# Altium schematic sheet ProtectionCPLD.SchDoc
size 594 x 420 mm; Address1: Address1; Address2: Address2; Address3: Address3; Address4: Address4; DocumentNumber: АБВГ.123456.001 Э3; SheetNumber: 4; SheetTotal: 5; Scale: 1:1; DocumentType: Схема электрическая принципиальная; FirstReferrence: АБВГ.123456.001
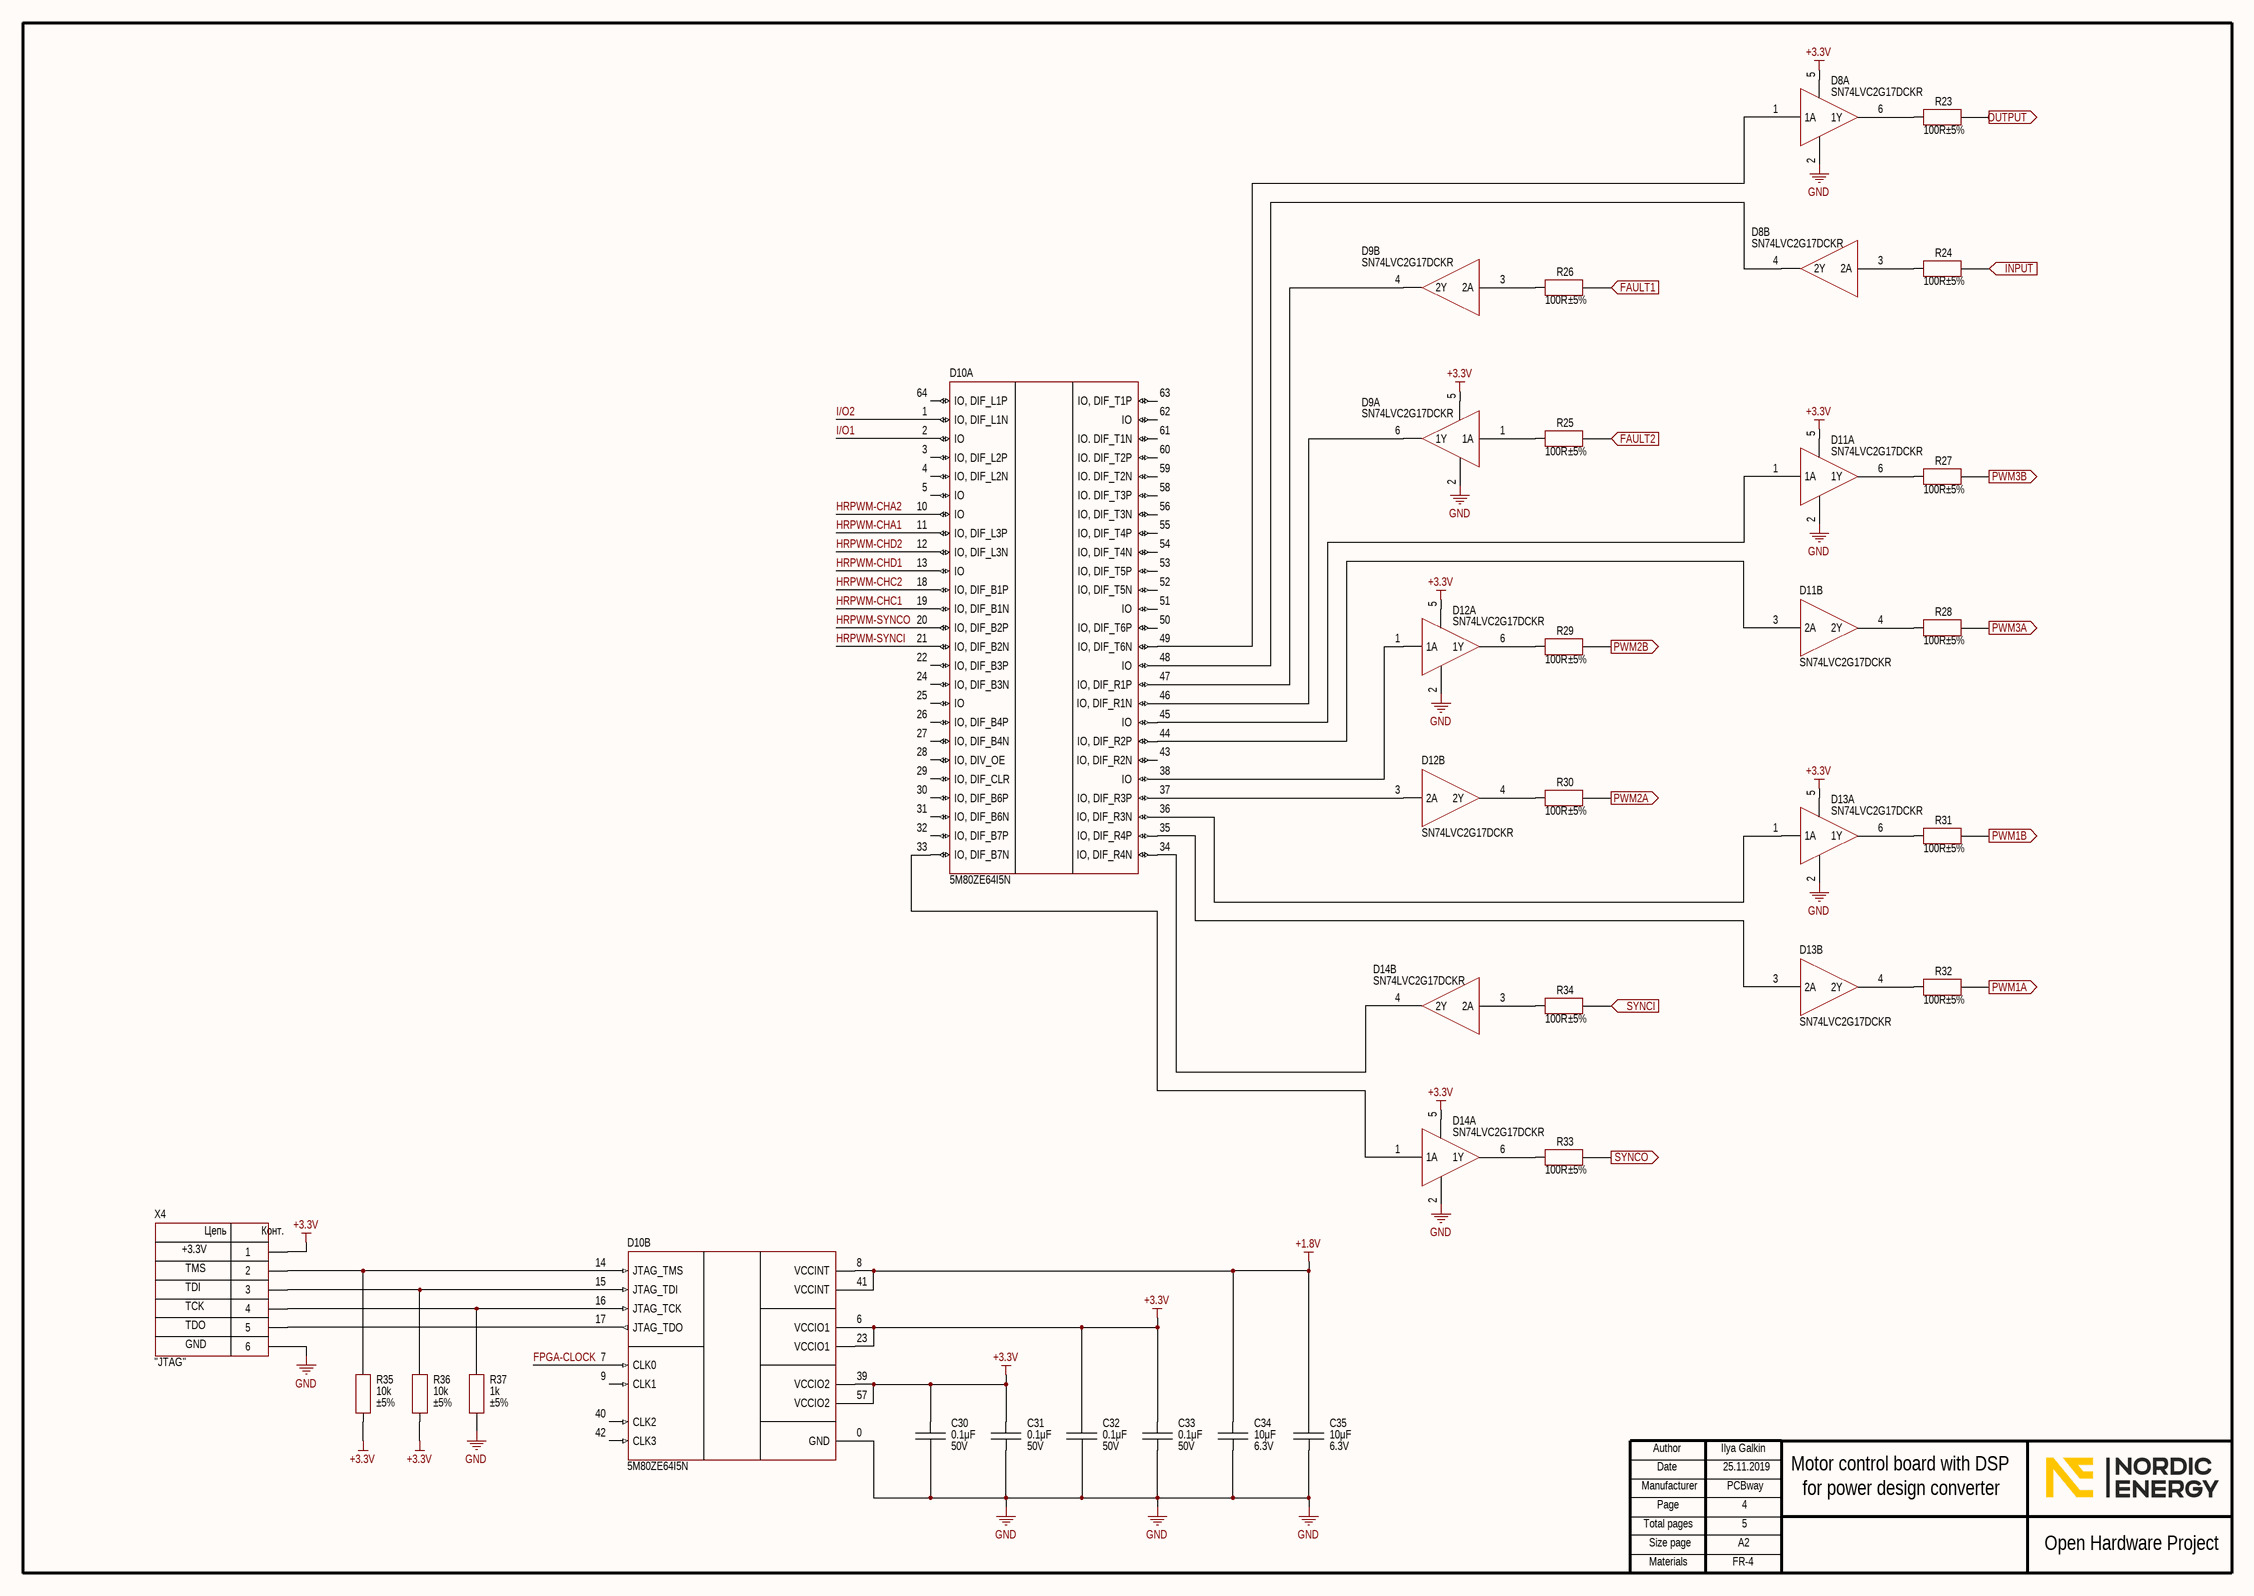
[diagram p0: ProtectionCPLD.SchDoc]

## Parts
C30  value 0.1μF  Voltage: 50V  [CAP: 0603]
C31  value 0.1μF  Voltage: 50V  [CAP: 0603]
C32  value 0.1μF  Voltage: 50V  [CAP: 0603]
C33  value 0.1μF  Voltage: 50V  [CAP: 0603]
C34  value 10μF  Voltage: 6.3V  [CAP: 0603]
C35  value 10μF  Voltage: 6.3V  [CAP: 0603]
D8  (no value)  [SC70-6]  (parts A,B of 2)
D9  (no value)  [SC70-6]  (parts A,B of 2)
D10  (no value)  [64-EQFP]  (parts A,B of 2)
D11  (no value)  [SC70-6]  (parts A,B of 2)
D12  (no value)  [SC70-6]  (parts A,B of 2)
D13  (no value)  [SC70-6]  (parts A,B of 2)
D14  (no value)  [SC70-6]  (parts A,B of 2)
R23  value 100R  Tolerance: ±5%  [RES: 0603]
R24  value 100R  Tolerance: ±5%  [RES: 0603]
R25  value 100R  Tolerance: ±5%  [RES: 0603]
R26  value 100R  Tolerance: ±5%  [RES: 0603]
R27  value 100R  Tolerance: ±5%  [RES: 0603]
R28  value 100R  Tolerance: ±5%  [RES: 0603]
R29  value 100R  Tolerance: ±5%  [RES: 0603]
R30  value 100R  Tolerance: ±5%  [RES: 0603]
R31  value 100R  Tolerance: ±5%  [RES: 0603]
R32  value 100R  Tolerance: ±5%  [RES: 0603]
R33  value 100R  Tolerance: ±5%  [RES: 0603]
R34  value 100R  Tolerance: ±5%  [RES: 0603]
R35  value 10k  Tolerance: ±5%  [RES: 0603]
R36  value 10k  Tolerance: ±5%  [RES: 0603]
R37  value 1k  Tolerance: ±5%  [RES: 0603]
X4  CommentText: "JTAG"  [CON: SM06B-GHS]

## Ports
FAULT1 (in), FAULT2 (in), INPUT (in), OUTPUT (out), PWM1A (out), PWM1B (out), PWM2A (out), PWM2B (out), PWM3A (out), PWM3B (out), SYNCI (in), SYNCO (out)

## Nets
+1.8V: C34.2 C35.2 D10.8(VCCINT) D10.41(VCCINT)
+3.3V: C30.2 C31.2 C32.2 C33.2 D8.5 D9.5 D10.6(VCCIO1) D10.23(VCCIO1) D10.39(VCCIO2) D10.57(VCCIO2) D11.5 D12.5 D13.5 D14.5 R35.1 R36.1 X4.1
GND: C30.1 C31.1 C32.1 C33.1 C34.1 C35.1 D8.2 D9.2 D10.0(GND) D11.2 D12.2 D13.2 D14.2 R37.1 X4.6
FAULT1: R26.2 ; port FAULT1
FAULT2: R25.2 ; port FAULT2
FPGA-CLOCK: D10.7(CLK0)
HRPWM-CHA1: D10.11(IO,_DIF_L3P)
HRPWM-CHA2: D10.10(IO)
HRPWM-CHC1: D10.19(IO,_DIF_B1N)
HRPWM-CHC2: D10.18(IO,_DIF_B1P)
HRPWM-CHD1: D10.13(IO)
HRPWM-CHD2: D10.12(IO,_DIF_L3N)
HRPWM-SYNCI: D10.21(IO,_DIF_B2N)
HRPWM-SYNCO: D10.20(IO,_DIF_B2P)
I/O1: D10.2(IO)
I/O2: D10.1(IO,_DIF_L1N)
INPUT: R24.2 ; port INPUT
OUTPUT: R23.2 ; port OUTPUT
PWM1A: R32.2 ; port PWM1A
PWM1B: R31.2 ; port PWM1B
PWM2A: R30.2 ; port PWM2A
PWM2B: R29.2 ; port PWM2B
PWM3A: R28.2 ; port PWM3A
PWM3B: R27.2 ; port PWM3B
SYNCI: R34.2 ; port SYNCI
SYNCO: R33.2 ; port SYNCO
NetD8_1: D8.1(1A) D10.49(IO,_DIF_T6N)
NetD8_3: D8.3(2A) R24.1
NetD8_4: D8.4(2Y) D10.48(IO)
NetD8_6: D8.6(1Y) R23.1
NetD9_1: D9.1(1A) R25.1
NetD9_3: D9.3(2A) R26.1
NetD9_4: D9.4(2Y) D10.47(IO,_DIF_R1P)
NetD9_6: D9.6(1Y) D10.46(IO,_DIF_R1N)
NetD10_14: D10.14(JTAG_TMS) R35.2 X4.2
NetD10_15: D10.15(JTAG_TDI) R36.2 X4.3
NetD10_16: D10.16(JTAG_TCK) R37.2 X4.4
NetD10_17: D10.17(JTAG_TDO) X4.5
NetD10_33: D10.33(IO,_DIF_B7N) D14.1(1A)
NetD10_34: D10.34(IO,_DIF_R4N) D14.4(2Y)
NetD10_35: D10.35(IO,_DIF_R4P) D13.3(2A)
NetD10_36: D10.36(IO,_DIF_R3N) D13.1(1A)
NetD10_37: D10.37(IO,_DIF_R3P) D12.3(2A)
NetD10_38: D10.38(IO) D12.1(1A)
NetD10_44: D10.44(IO,_DIF_R2P) D11.3(2A)
NetD10_45: D10.45(IO) D11.1(1A)
NetD11_4: D11.4(2Y) R28.1
NetD11_6: D11.6(1Y) R27.1
NetD12_4: D12.4(2Y) R30.1
NetD12_6: D12.6(1Y) R29.1
NetD13_4: D13.4(2Y) R32.1
NetD13_6: D13.6(1Y) R31.1
NetD14_3: D14.3(2A) R34.1
NetD14_6: D14.6(1Y) R33.1

Not connected (* = marked no-connect by the designer): D10 3(IO,_DIF_L2P) 4(IO,_DIF_L2N) 5(IO) 9(CLK1) 22(IO,_DIF_B3P) 24(IO,_DIF_B3N) 25(IO) 26(IO,_DIF_B4P) 27(IO,_DIF_B4N) 28(IO,_DIV_OE) 29(IO,_DIF_CLR) 30(IO,_DIF_B6P) 31(IO,_DIF_B6N) 32(IO,_DIF_B7P) 40(CLK2) 42(CLK3) 43(IO,_DIF_R2N) 50(IO,_DIF_T6P) 51(IO) 52(IO,_DIF_T5N) 53(IO,_DIF_T5P) 54(IO,_DIF_T4N) 55(IO,_DIF_T4P) 56(IO,_DIF_T3N) 58(IO._DIF_T3P) 59(IO._DIF_T2N) 60(IO._DIF_T2P) 61(IO._DIF_T1N) 62(IO) 63(IO,_DIF_T1P) 64(IO,_DIF_L1P)

## Notes on the sheet
- +3.3V
- TMS
- TDI
- TCK
- TDO
- GND
- Ilya Galkin
- 25.11.2019
- PCBway
- 4
- Motor control board with DSP
- for power design converter
- 5
- FR-4
- Author
- Manufacturer
- Date
- Page
- Total pages
- Size page
- A2
- Open Hardware Project
- Materials
- (in symbol Connector_SM06B) Цепь; Конт.

## Library data of the parts
C30-C33 = Ceramic_0603: Manufacturer: Samsung; PartNumber: CL10B104KB8NNNC; ValueManufacturerPartNumber: Ceramic capacitor, 0.1μF, X7R, ±10%, 50V, 0603, -55...+125°C; TypeCapacitor: Ceramic capacitor; Tolerance: ±10%; TypeDielectric: X7R; Package: 0603; HelpURL: https://www.digikey.com/product-detail/en/samsung-electro-mechanics/CL10B104KB8NNNC/1276-1000-1-ND/3889086; Temperature: -55...+125°C
C34 C35 = Ceramic_0603: Manufacturer: Samsung; PartNumber: CL10B106MQ8NRNC; ValueManufacturerPartNumber: Ceramic capacitor, 10μF, X7R, ±10%, 6.3V, 0603, -55...+125°C; TypeCapacitor: Ceramic capacitor; Tolerance: ±10%; TypeDielectric: X7R; Package: 0603; HelpURL: https://www.digikey.com/product-detail/en/samsung-electro-mechanics/CL10B106MQ8NRNC/1276-1948-1-ND/3890034; Temperature: -55...+125°C
D8 D9 D11-D14 = SN74LVC2G17DCKR: Buffer; Manufacturer: Texas Instruments; ValueManufacturerPartNumber: IC logic buffer, 1.65...5.5V, -40...+125°C, SC-70-6; Supply: 1.65...5.5V; HelpURL: https://www.digikey.com/product-detail/en/texas-instruments/SN74LVC2G17DCKR/296-13013-1-ND/479736; Package: SC-70-6; ComponentType: IC logic buffer; Temperature: -40...+125°C; PartNumber: SN74LVC2G17DCKR
D10 = 5M80ZE64I5N: CPLD Max V; Manufacturer: Intel; ValueManufacturerPartNumber: IC CPLD logic, MAX V, 100MHz, 80LE, 1.71...1.89V, -40...+100°C, 64-EQFP; Supply: 1.71...1.89V; Speed: 100MHz; LogicElements: 80LE; HelpURL: https://www.digikey.com/product-detail/en/intel/5M80ZE64I5N/544-2817-ND/2660734; Package: 64-EQFP; ComponentType: IC CPLD logic; Temperature: -40...+100°C; Series: MAX V; PartNumber: 5M80ZE64I5N
R23-R34 = Resistor_0603: Manufacturer: Yageo; PartNumber: RC0603JR-07100RL; ValueManufacturerPartNumber: Resistor film, 100R, ±5%, 0603, 0.1W, -55...+125°C; TypeResistor: Resistor film; Power: 0.1W; Package: 0603; HelpURL: https://www.digikey.com/product-detail/en/yageo/RC0603JR-07100RL/311-100GRCT-ND/729644; Temperature: -55...+125°C
R35 R36 = Resistor_0603: Manufacturer: Yageo; PartNumber: RC0603JR-0710KL; ValueManufacturerPartNumber: Resistor film, 10k, ±5%, 0603, 0.1W, -55...+125°C; TypeResistor: Resistor film; Power: 0.1W; Package: 0603; HelpURL: https://www.digikey.com/product-detail/en/yageo/RC0603JR-0710KL/311-10KGRCT-ND/729647; Temperature: -55...+125°C
R37 = Resistor_0603: Manufacturer: Yageo; PartNumber: RC0603JR-071KL; ValueManufacturerPartNumber: Resistor film, 1k, ±5%, 0603, 0.1W, -55...+125°C; TypeResistor: Resistor film; Power: 0.1W; Package: 0603; HelpURL: https://www.digikey.com/product-detail/en/yageo/RC0603JR-071KL/311-1.0KGRCT-ND/729624; Temperature: -55...+125°C
X4 = Connector_SM06B: Manufacturer: JST; ValueManufacturerPartNumber: Connector, 6pin, 1.25mm, 50VDC, 1A; PartNumber: SM06B-GHS; VoltageMax: 50VDC; Pitch: 1.25mm; CurrentMax: 1A; Multichannel: 6pin; HelpURL: https://www.digikey.com/product-detail/en/jst-sales-america-inc/SM06B-GHS-TB-LF-SN/455-1568-1-ND/807836; TypeConnector: Connector